# Altium schematic sheet MCP23017.SchDoc
size A
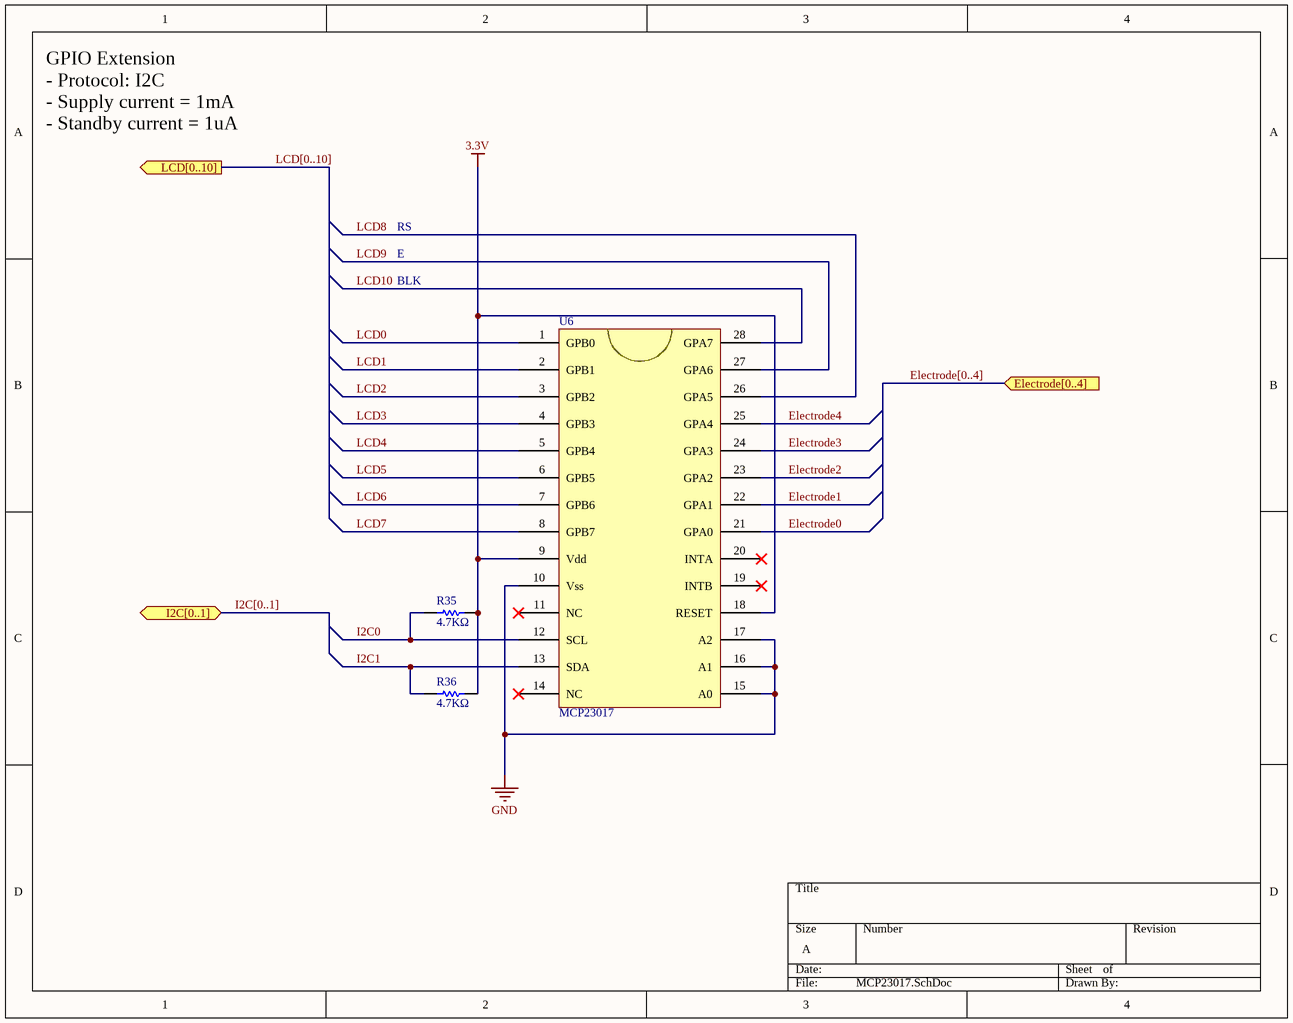
[diagram p0: MCP23017.SchDoc]

## Parts
R35  4.7KΩ  [R0603]
R36  4.7KΩ  [R0603]
U6  MCP23017  [MCP23017]

## Ports
Electrode[0..4] (in), I2C[0..1] (bidir), LCD[0..10] (out)

## Nets
3.3V: R35.2 R36.2 U6.9(Vdd) U6.18(RESET)
GND: U6.10(Vss) U6.15(A0) U6.16(A1) U6.17(A2)
Electrode0: U6.21(GPA0)
Electrode1: U6.22(GPA1)
Electrode2: U6.23(GPA2)
Electrode3: U6.24(GPA3)
Electrode4: U6.25(GPA4)
I2C0: R35.1 U6.12(SCL)
I2C1: R36.1 U6.13(SDA)
LCD0: U6.1(GPB0)
LCD1: U6.2(GPB1)
LCD2: U6.3(GPB2)
LCD3: U6.4(GPB3)
LCD4: U6.5(GPB4)
LCD5: U6.6(GPB5)
LCD6: U6.7(GPB6)
LCD7: U6.8(GPB7)
LCD8: U6.26(GPA5)
LCD9: U6.27(GPA6)
LCD10: U6.28(GPA7)

Not connected (* = marked no-connect by the designer): U6 11(NC)* 14(NC)* 19(INTB)* 20(INTA)*

## Buses and harness runs
bus Electrode[0..4] = port Electrode[0..4]
bus I2C[0..1] = port I2C[0..1]
bus LCD[0..10] = port LCD[0..10]

## Notes on the sheet
- GPIO Extension
  - Protocol: I2C
  - Supply current = 1mA
  - Standby current = 1uA
- RS
- E
- BLK

## Library data of the parts
R35 R36 = Res1: Resistor; Manufacturer: MULTICOMP; Ref.Manufacturer: MC0063W060314K7; Value: 1K; Published: 8-Jun-2000; LatestRevisionDate: 17-Jul-2002; LatestRevisionNote: Re-released for DXP Platform.; PackageReference: AXIAL-0.3; Publisher: Altium Limited; PackageDescription: Axial Device, Thru-Hole; 2 Leads; 0.3 in Pin Spacing; Ref.Farnell: 9331247; Supplier: Farnell
U6 = MPC23017: GPIOExpander; Manufacturer: MICROCHIP; Ref.Manufacturer: MCP23017-E/SO; Ref.Farnell: 1332087; Supplier: Farnell